# Altium schematic sheet FPGA_52_Morse.SchDoc: LiveDesign Evaluation - Morse Code
size A; Organization: Altium Limited; Address1: L3, 12a Rodborough Rd; Address2: Frenchs Forest; Address3: NSW; Address4: Australia 2086; DocumentNumber: 1; SheetNumber: 1; SheetTotal: 2
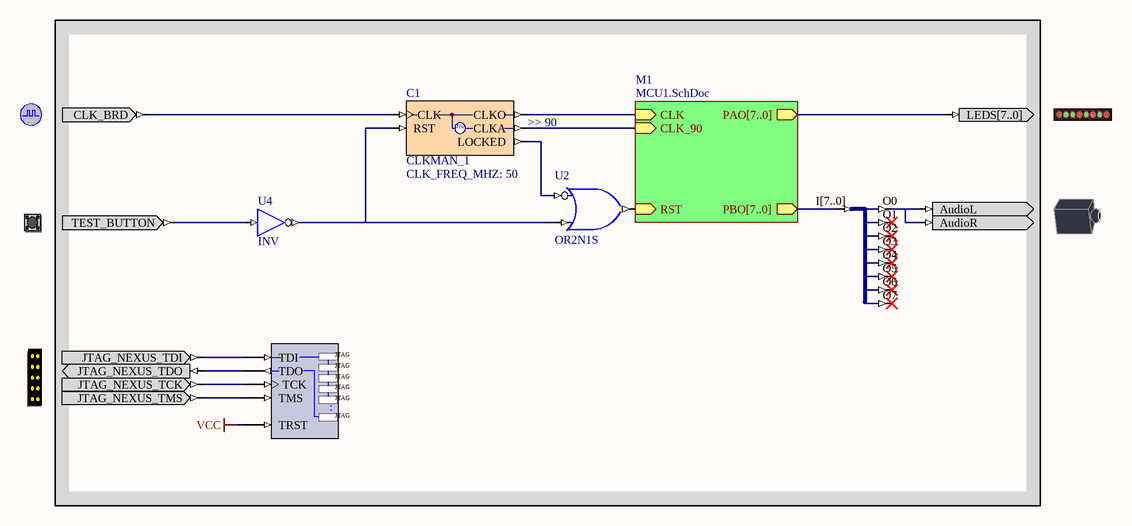
[diagram p0: FPGA_52_Morse.SchDoc]

## Parts
(Parts that share a designator on the sheet are numbered #1, #2 ... from top to bottom, then left to right.)
?#1  LED  (value not drawn)
?#2  CLOCK_BOARD  (value not drawn)
?#3  TEST_BUTTON  (value not drawn)
?#4  AUDIO_DAC  (value not drawn)
?#5  NEXUS_JTAG_CONNECTOR  (value not drawn)
C1  CLKMAN_1  CLK_FREQ_MHZ: 50  ClkA_Operation: >> 90
NEXUS_JTAG_PORT  NEXUS_JTAG_PORT  (value not drawn)
U2  OR2N1S
U3  J8B_8S  (value not drawn)
U4  INV

## Sub-sheets
M1 = MCU1.SchDoc: CLK (in), RST (in), PAO[7..0] (out), PBO[7..0] (out), CLK_90 (in)

## Nets
VCC: NEXUS_JTAG_PORT.TRST
Net?#1_LEDS[7..0]: ?#1.LEDS[7..0] ; sheet M1/PAO[7..0]
Net?#2_CLK_BRD: ?#2.CLK_BRD C1.CLK
Net?#3_TEST_BUTTON: ?#3.TEST_BUTTON U4.I
Net?#4_AudioL: ?#4.AudioL ?#4.AudioR U3.O0
Net?#5_JTAG_NEXUS_TCK: ?#5.JTAG_NEXUS_TCK NEXUS_JTAG_PORT.TCK
Net?#5_JTAG_NEXUS_TDI: ?#5.JTAG_NEXUS_TDI NEXUS_JTAG_PORT.TDI
Net?#5_JTAG_NEXUS_TDO: ?#5.JTAG_NEXUS_TDO NEXUS_JTAG_PORT.TDO
Net?#5_JTAG_NEXUS_TMS: ?#5.JTAG_NEXUS_TMS NEXUS_JTAG_PORT.TMS
NetC1_CLKA: C1.CLKA ; sheet M1/CLK_90
NetC1_CLKO: C1.CLKO ; sheet M1/CLK
NetC1_LOCKED: C1.LOCKED U2.I0
NetC1_RST: C1.RST U2.I1 U4.O
NetU2_O: U2.O ; sheet M1/RST
NetU3_I[7..0]: U3.I[7..0] ; sheet M1/PBO[7..0]

Not connected (* = marked no-connect by the designer): U3 O1* O2* O3* O4* O5* O6* O7*

## Notes on the sheet
- Title
- Size:
- Date:
- A
- Number:
- Time:
- Revision:
- Sheet
- of
- File:
- (in symbol CLKMAN_1) F(x)
- (in symbol NEXUS_JTAG_PORT) JTAG; .

## Library data of the parts
?#1 = LED: 8-Way LEDS; PortComponent: True; Published: 19-Nov-2003; Publisher: Altium Limited
?#2 = CLOCK_BOARD: Global System Clock Supply; PortComponent: True; Published: 19-Nov-2003; Publisher: Altium Limited
?#3 = TEST_BUTTON: Test Button; PortComponent: True; Published: 19-Nov-2003; Publisher: Altium Limited
?#4 = AUDIO_DAC: Stero Audio Output Jack; PortComponent: True; Published: 19-Nov-2003; Publisher: Altium Limited
?#5 = NEXUS_JTAG_CONNECTOR: JTAG Port; PortComponent: True; Published: 19-Nov-2003; Publisher: Altium Limited
C1 = CLKMAN_1: Single Operational Output Clock Manager; Clk_Count: 1; Published: 5-Jul-2004; Publisher: Altium Limited; Core Revision: 1.00.00; Nexus_Core: ClockManager; HelpURL: CR0118 FPGA Generic Library Guide.pdf#page=148; Functional Class: Clock Manager; Port Size: 1
NEXUS_JTAG_PORT = NEXUS_JTAG_PORT: Soft Nexus-Chain Connector; NEXUS_JTAG_CONNECTOR: True; Published: 18-Dec-2003; Publisher: Altium Limited
U2 = OR2N1S: 2-Input OR Gate with Active Low A Input, Single Pin Version; Xilinx Equivalent: OR2B1; ArchiveName: GENERIC; VHDLIB_SIM: GENERIC_LIB; Published: 29-Jan-2004; Publisher: Altium Limited; Core Revision: 1.00.00
U3 = J8B_8S: 8-Bit input bus to 8 single pin outputs; ArchiveName: GENERIC; VHDLIB_SIM: GENERIC_LIB; Published: 29-Jan-2004; Publisher: Altium Limited; Core Revision: 1.00.00
U4 = INV: Inverter; ArchiveName: GENERIC; VHDLIB_SIM: GENERIC_LIB; Published: 29-Jan-2004; Publisher: Altium Limited; Xilinx Equivalent: INV; Core Revision: 1.00.00